# Altium schematic sheet PLD_Connectors_Piggyback.SchDoc: Connectors - Piggyback
size A4; ApprovedBy: Piotr Kuligowski; CheckedBy: Piotr Kuligowski; Author: Michał Gumiela; SheetNumber: 3; SheetTotal: 13
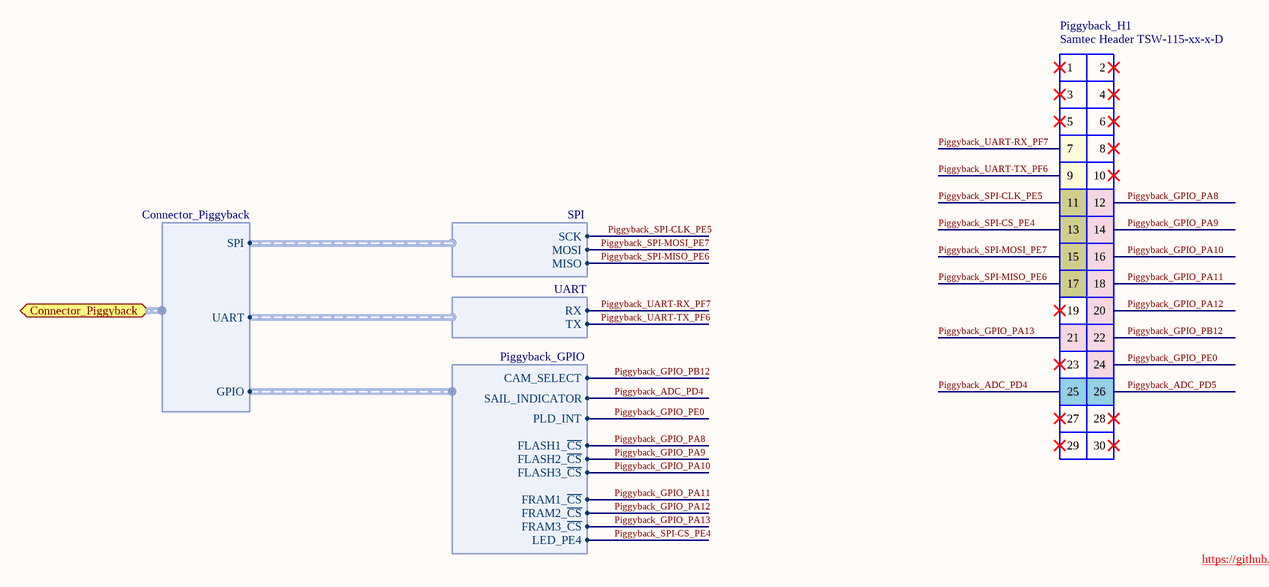
[diagram p0: PLD_Connectors_Piggyback.SchDoc]

## Parts
Piggyback_H1  Samtec Header TSW-115-xx-x-D  [Samtec_TSW-115-07-L-D]

## Ports
Connector_Piggyback (harness Connector_Piggyback)

## Harnesses
SPI: MISO, MOSI, SCK
UART: RX, TX
Connector_Piggyback: SPI, UART, GPIO
Piggyback_GPIO: CAM_SELECT, FLASH1_~{CS}, FRAM1_~{CS}, PLD_INT, FLASH2_~{CS}, FLASH3_~{CS}, FRAM2_~{CS}, FRAM3_~{CS}, SAIL_INDICATOR, LED_PE4

## Nets
Piggyback_ADC_PD4: Piggyback_H1.25 ; harness Piggyback_GPIO.SAIL_INDICATOR
Piggyback_ADC_PD5: Piggyback_H1.26
Piggyback_GPIO_PA8: Piggyback_H1.12 ; harness Piggyback_GPIO.FLASH1_~{CS}
Piggyback_GPIO_PA9: Piggyback_H1.14 ; harness Piggyback_GPIO.FLASH2_~{CS}
Piggyback_GPIO_PA10: Piggyback_H1.16 ; harness Piggyback_GPIO.FLASH3_~{CS}
Piggyback_GPIO_PA11: Piggyback_H1.18 ; harness Piggyback_GPIO.FRAM1_~{CS}
Piggyback_GPIO_PA12: Piggyback_H1.20 ; harness Piggyback_GPIO.FRAM2_~{CS}
Piggyback_GPIO_PA13: Piggyback_H1.21 ; harness Piggyback_GPIO.FRAM3_~{CS}
Piggyback_GPIO_PB12: Piggyback_H1.22 ; harness Piggyback_GPIO.CAM_SELECT
Piggyback_GPIO_PE0: Piggyback_H1.24 ; harness Piggyback_GPIO.PLD_INT
Piggyback_SPI-CLK_PE5: Piggyback_H1.11 ; harness SPI.SCK
Piggyback_SPI-CS_PE4: Piggyback_H1.13 ; harness Piggyback_GPIO.LED_PE4
Piggyback_SPI-MISO_PE6: Piggyback_H1.17 ; harness SPI.MISO
Piggyback_SPI-MOSI_PE7: Piggyback_H1.15 ; harness SPI.MOSI
Piggyback_UART-RX_PF7: Piggyback_H1.7 ; harness UART.RX
Piggyback_UART-TX_PF6: Piggyback_H1.9 ; harness UART.TX

Not connected (* = marked no-connect by the designer): Piggyback_H1 1* 2* 3* 4* 5* 6* 8* 10* 19* 23* 27* 28* 29* 30*

## Notes on the sheet
- https://github.com/PW-Sat2/Documentation/raw/master/obc/obc_datasheet_esl_cubecomputer.pdf
- Title:
- Project:
- Author:
- Model:
- Document Number:
- Checked by:
- Rev:
- Date:
- Approved by:
- Sheet:
- of
- File name:

## Library data of the parts
Piggyback_H1 = Samtec_TSW-115-xx-x-D: Samtec TSW Series Header , 2.54mm pitch, 2x15pin. PC-104 Stack Connector.; HelpUrl: http://suddendocs.samtec.com/catalog_english/htsw_th.pdf; Value: Samtec Header TSW-115-xx-x-D